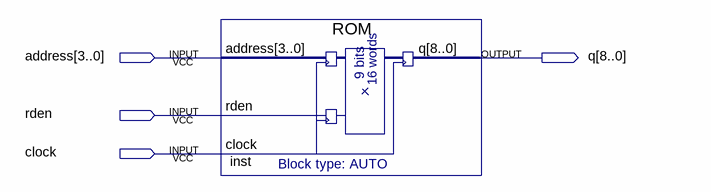
[diagram p0: schematic sheet]
// Quartus schematic 2012510017_Lab2_2.bdf as structural Verilog: 1 symbols, 4 pins
module \2012510017_Lab2_2  (
  input  [3:0] address,
  input  rden,
  input  clock,
  output [8:0] q
);

  ROM inst (.address(address), .rden(rden), .clock(clock), .q(q));
endmodule
